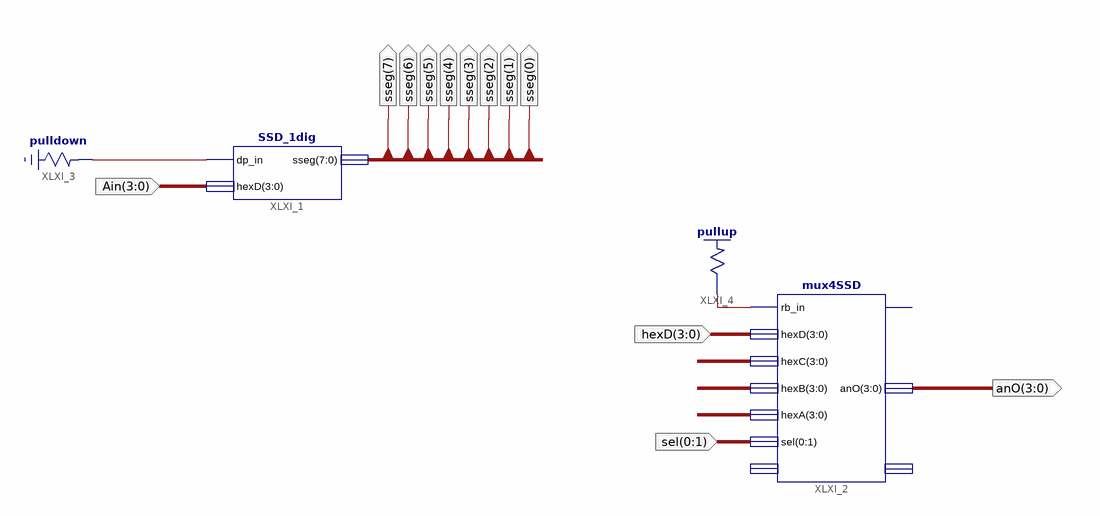
[diagram p0: schematic sheet 1]
// Xilinx ISE schematic Lab6_Ex2.sch (spartan3e) as structural Verilog: 4 symbols, 12 ports
module Lab6_Ex2 (
  input  [3:0] Ain,
  input  [0:1] sel,
  input  [3:0] hexD,
  output [3:0] anO,
  output [7:0] sseg
);

  wire XLXN_3, XLXN_27;
  wire [3:0] XLXN_36, XLXN_37, XLXN_38;

  SSD_1dig XLXI_1 (.dp_in(XLXN_3), .hexD(Ain), .sseg(sseg));
  mux4SSD XLXI_2 (
    .rb_in(XLXN_27), .hexD(hexD), .hexC(XLXN_36), .hexB(XLXN_37), .hexA(XLXN_38), .sel(sel), .anO(anO));  // open: dp_in, dpO, hexO
  \pulldown  XLXI_3 (.O(XLXN_3));
  \pullup  XLXI_4 (.O(XLXN_27));
endmodule
